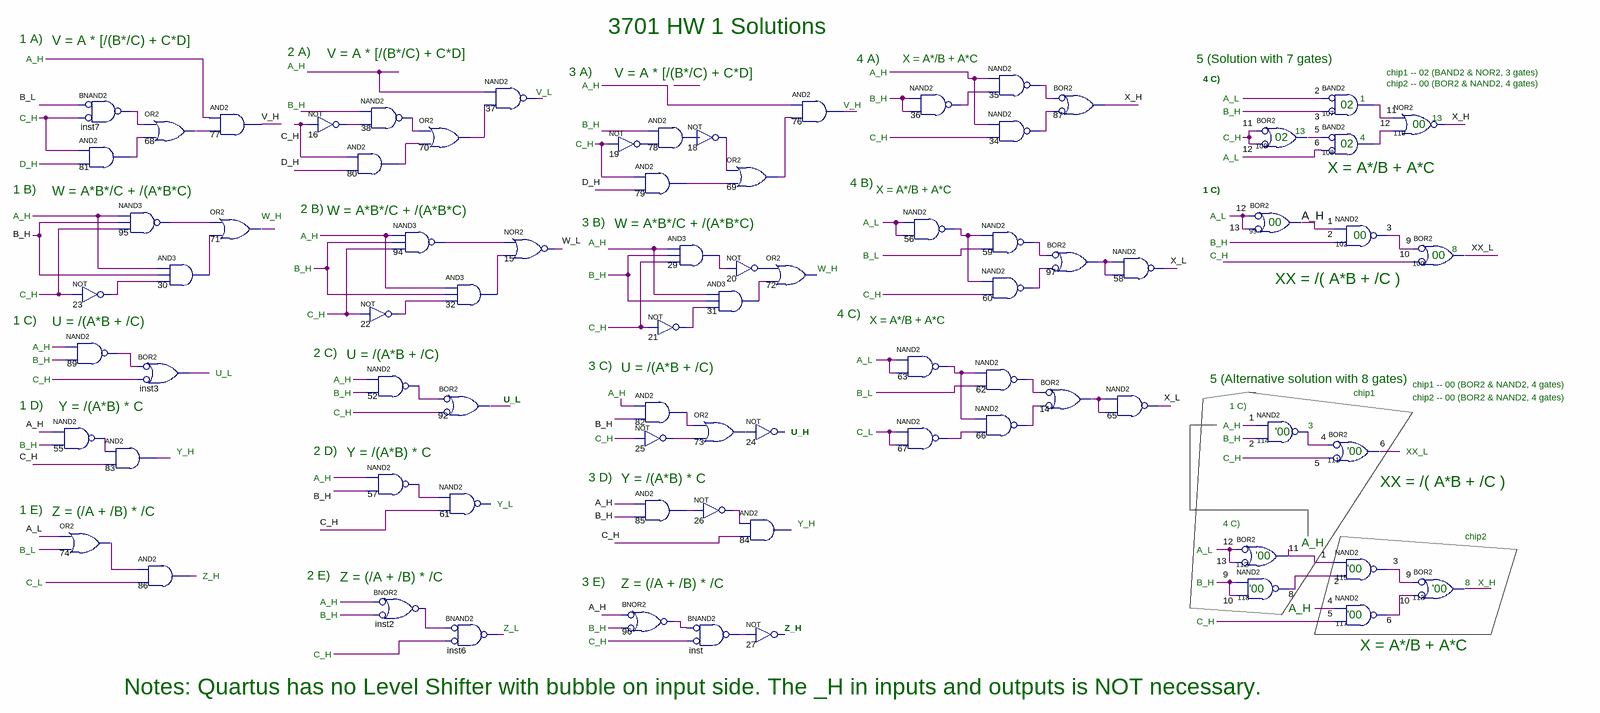
[diagram p0: schematic sheet]
// Quartus schematic hw1_sol.bdf as structural Verilog: 79 symbols, 0 pins
module hw1_sol (
);

  wire \1 , \2 , \3 , \4 , \5 , A_L, B_H, B_L, C_H, D_H, inst2_out, inst3_out, inst6_out, inst7_out,
       inst_out, n14_out, n16_out, n18_out, n19_out, n20_out, n21_out, n22_out, n23_out, n25_out, n26_out,
       n29_out, n30_out, n31_out, n32_out, n34_out, n35_out, n36_out, n37_out, n38_out, n52_out, n55_out,
       n56_out, n57_out, n59_out, n60_out, n62_out, n63_out, n66_out, n67_out, n68_out, n69_out, n70_out,
       n71_out, n73_out, n74_out, n76_out, n79_out, n80_out, n81_out, n82_out, n83_out, n85_out, n86_out,
       n89_out, n92_out, n94_out, n95_out, n96_out, n97_out, n113_out, undriven, undriven_2, undriven_3,
       undriven_4, undriven_5, undriven_6, undriven_7, undriven_8, undriven_9, undriven_10, undriven_11,
       undriven_12, undriven_13, undriven_14, undriven_15, undriven_16, undriven_17, undriven_18,
       undriven_19, undriven_20, undriven_21, undriven_22, undriven_23, undriven_24, undriven_25,
       undriven_26, undriven_27, undriven_28, undriven_29, undriven_30, undriven_31, undriven_32,
       undriven_33, undriven_34, undriven_35, undriven_36, undriven_37, undriven_38, undriven_39,
       undriven_40, undriven_41, undriven_42, V_H, W_L, X_H, X_L, XX_L;

  nand u_89 (n89_out, undriven_17, undriven_13);
  nand u_55 (n55_out, \1 , undriven_9);
  or u_74 (n74_out, A_L, undriven_7);
  nand inst7 (inst7_out, ~B_L, ~undriven_34);  // BNAND2
  and u_81 (n81_out, undriven_34, undriven_35);
  nand u_95 (n95_out, undriven_18, B_H, undriven_23);
  not u_23 (n23_out, undriven_23);
  and u_83 (n83_out, n55_out, C_H);
  or u_68 (n68_out, inst7_out, n81_out);
  and u_30 (n30_out, undriven_18, B_H, n23_out);
  or inst3 (inst3_out, ~n89_out, ~undriven_12);  // BOR2
  and u_86 (n86_out, n74_out, undriven_4);
  and u_77 (V_H, undriven_36, n68_out);
  or u_71 (n71_out, n95_out, n30_out);
  not u_16 (n16_out, C_H);
  nand u_38 (n38_out, undriven_27, n16_out);
  and u_80 (n80_out, C_H, D_H);
  not u_22 (n22_out, undriven_25);
  nand u_52 (n52_out, undriven_14, undriven_15);
  nand u_57 (n57_out, undriven_8, B_H);
  nor inst2 (inst2_out, ~undriven_6, ~undriven_5);  // BNOR2
  or u_70 (n70_out, n38_out, n80_out);
  nand u_94 (n94_out, undriven_19, undriven_24, undriven_25);
  nand u_37 (n37_out, undriven_33, n70_out);
  and u_32 (n32_out, undriven_19, undriven_24, n22_out);
  or u_92 (n92_out, ~n52_out, ~undriven_10);  // BOR2
  // NAND2 61 has open pins: IN1=n57_out, IN2=C_H, OUT=open
  nand inst6 (inst6_out, ~inst2_out, ~undriven);  // BNAND2
  nor u_15 (W_L, n94_out, n32_out);
  not u_19 (n19_out, undriven_26);
  and u_79 (n79_out, undriven_26, D_H);
  and u_82 (n82_out, undriven_16, B_H);
  not u_25 (n25_out, undriven_11);
  and u_85 (n85_out, \1 , B_H);
  nor u_96 (n96_out, ~\1 , ~undriven_3);  // BNOR2
  // AND2 78 has open pins: IN1=undriven_28, IN2=n19_out, OUT=open
  // NOT 18 has open pins: IN=open, OUT=n18_out
  and u_29 (n29_out, undriven_22, undriven_20, undriven_21);
  not u_21 (n21_out, undriven_21);
  or u_73 (n73_out, n82_out, n25_out);
  not u_26 (n26_out, n85_out);
  nand inst (inst_out, ~n96_out, ~undriven_2);  // BNAND2
  or u_69 (n69_out, n18_out, n79_out);
  not u_20 (n20_out, n29_out);
  and u_31 (n31_out, undriven_22, undriven_20, n21_out);
  // NOT 24 has open pins: IN=n73_out, OUT=open
  // AND2 84 has open pins: IN1=n26_out, IN2=C_H, OUT=open
  // NOT 27 has open pins: IN=inst_out, OUT=open
  and u_76 (n76_out, undriven_31, n69_out);
  // OR2 72 has open pins: IN1=n20_out, IN2=n31_out, OUT=open
  nand u_56 (n56_out, undriven_40, undriven_40);
  nand u_63 (n63_out, undriven_42, undriven_42);
  nand u_67 (n67_out, undriven_37, undriven_37);
  nand u_36 (n36_out, undriven_30, undriven_30);
  nand u_35 (n35_out, undriven_32, n36_out);
  nand u_34 (n34_out, undriven_32, undriven_29);
  nand u_59 (n59_out, n56_out, undriven_41);
  nand u_60 (n60_out, n56_out, undriven_39);
  nand u_62 (n62_out, n63_out, undriven_38);
  nand u_66 (n66_out, n63_out, n67_out);
  or u_87 (X_H, ~n35_out, ~n34_out);  // BOR2
  or u_97 (n97_out, ~n59_out, ~n60_out);  // BOR2
  or u_14 (n14_out, ~n62_out, ~n66_out);  // BOR2
  nand u_58 (X_L, n97_out, n97_out);
  nand u_65 (X_L, n14_out, n14_out);
  or u_109 (\5 , ~\1 , ~\1 );  // BOR2
  or u_99 (\1 , ~\3 , ~\3 );  // BOR2
  nand u_114 (\4 , \1 , \2 );
  or u_112 (\1 , ~\3 , ~\3 );  // BOR2
  nand u_118 (\2 , \3 , \3 );
  and u_107 (\1 , ~\2 , ~\3 );  // BAND2
  and u_108 (\3 , ~\5 , ~\3 );  // BAND2
  nand u_102 (\3 , \1 , \2 );
  or u_111 (\3 , ~\4 , ~\5 );  // BOR2
  nand u_115 (\3 , \1 , \2 );
  nand u_117 (\3 , \4 , \5 );
  nor u_110 (X_H, \1 , \3 );
  or u_100 (XX_L, ~\3 , ~\3 );  // BOR2
  or u_113 (n113_out, ~\3 , ~\3 );  // BOR2

  // Other names for the same wires on the sheet: 8 = \2 ; 6 = \3 ; 9 = \3 ; 10 = \3 ; 12 = \3 ; 13 = \3 ; 11 = \1 ;
  //   A_H = \1 

  // Notes on the sheet:
  //   3701 HW 1 Solutions 
  //   1 A)
  //   V = A * [/(B*/C) + C*D]
  //   2 A)
  //   V = A * [/(B*/C) + C*D]
  //   4 A)
  //   5 (Solution with 7 gates)
  //   X = A*/B + A*C
  //   A_H
  //   A_H
  //   3 A)
  //   V = A * [/(B*/C) + C*D]
  //   A_H
  //   chip1 -- 02 (BAND2 & NOR2, 3 gates)
  //   4 C)
  //   chip2 -- 00 (BOR2 & NAND2, 4 gates)
  //   A_H
  //   V_L
  //   B_H
  //   A_L
  //   1
  //   02
  //   B_H
  //   V_H
  //   B_H
  //   C_H
  //   13
  //   00
  //   B_H
  //   13
  //   02
  //   C_H
  //   C_H
  //   4
  //   02
  //   C_H
  //   A_L
  //   D_H
  //   X = A*/B + A*C
  //   4 B)
  //   1 B)
  //   W = A*B*/C + /(A*B*C)
  //   X = A*/B + A*C
  //   1 C)
  //   2 B)
  //   W = A*B*/C + /(A*B*C)
  //   A_H
  //   W_H
  //   A_L
  //   3 B)
  //   W = A*B*/C + /(A*B*C)
  //   00
  //   A_L
  //   00
  //   A_H
  //   A_H
  //   B_H
  //   8
  //   00
  //   B_L
  //   C_H
  //   B_H
  //   W_H
  //   B_H
  //   XX = /( A*B + /C )
  //   C_H
  //   C_H
  //   4 C)
  //   C_H
  //   1 C)
  //   U = /(A*B + /C)
  //   X = A*/B + A*C
  //   C_H
  //   A_H
  //   2 C)
  //   U = /(A*B + /C)
  //   B_H
  //   A_L
  //   3 C)
  //   U = /(A*B + /C)
  //   U_L
  //   5 (Alternative solution with 8 gates)
  //   C_H
  //   A_H
  //   chip1 -- 00 (BOR2 & NAND2, 4 gates)
  //   B_H
  //   A_H
  //   B_L
  //   chip1
  //   chip2 -- 00 (BOR2 & NAND2, 4 gates)
  //   U_L
  //   1 D)
  //   Y = /(A*B) * C
  //   1 C)
  //   C_H
  //   A_H
  //   3
  //   '00
  //   U_H
  //   C_L
  //   C_H
  //   B_H
  //   B_H
  //   2 D)
  //   Y = /(A*B) * C
  //   '00
  //   Y_H
  //   XX_L
  //   C_H
  //   3 D)
  //   Y = /(A*B) * C
  //   A_H
  //   XX = /( A*B + /C )
  //   Y_L
  //   1 E)
  //   Z = (/A + /B) * /C
  //   Y_H
  //   4 C)
  //   chip2
  //   A_H
  //   B_L
  //   A_L
  //   '00
  //   '00
  //   2 E)
  //   Z = (/A + /B) * /C
  //   Z_H
  //   3 E)
  //   Z = (/A + /B) * /C
  //   C_L
  //   B_H
  //   8
  //   X_H
  //   '00
  //   '00
  //   A_H
  //   A_H
  //   '00
  //   B_H
  //   C_H
  //   Z_L
  //   B_H
  //   Z_H
  //   C_H
  //   X = A*/B + A*C
  //   C_H
  //   Notes: Quartus has no Level Shifter with bubble on input side. The _H in inputs and outputs is NOT necessary.
endmodule
